# Altium schematic sheet [02] CPU 1214C DC_DC_DC.SchDoc
size A4
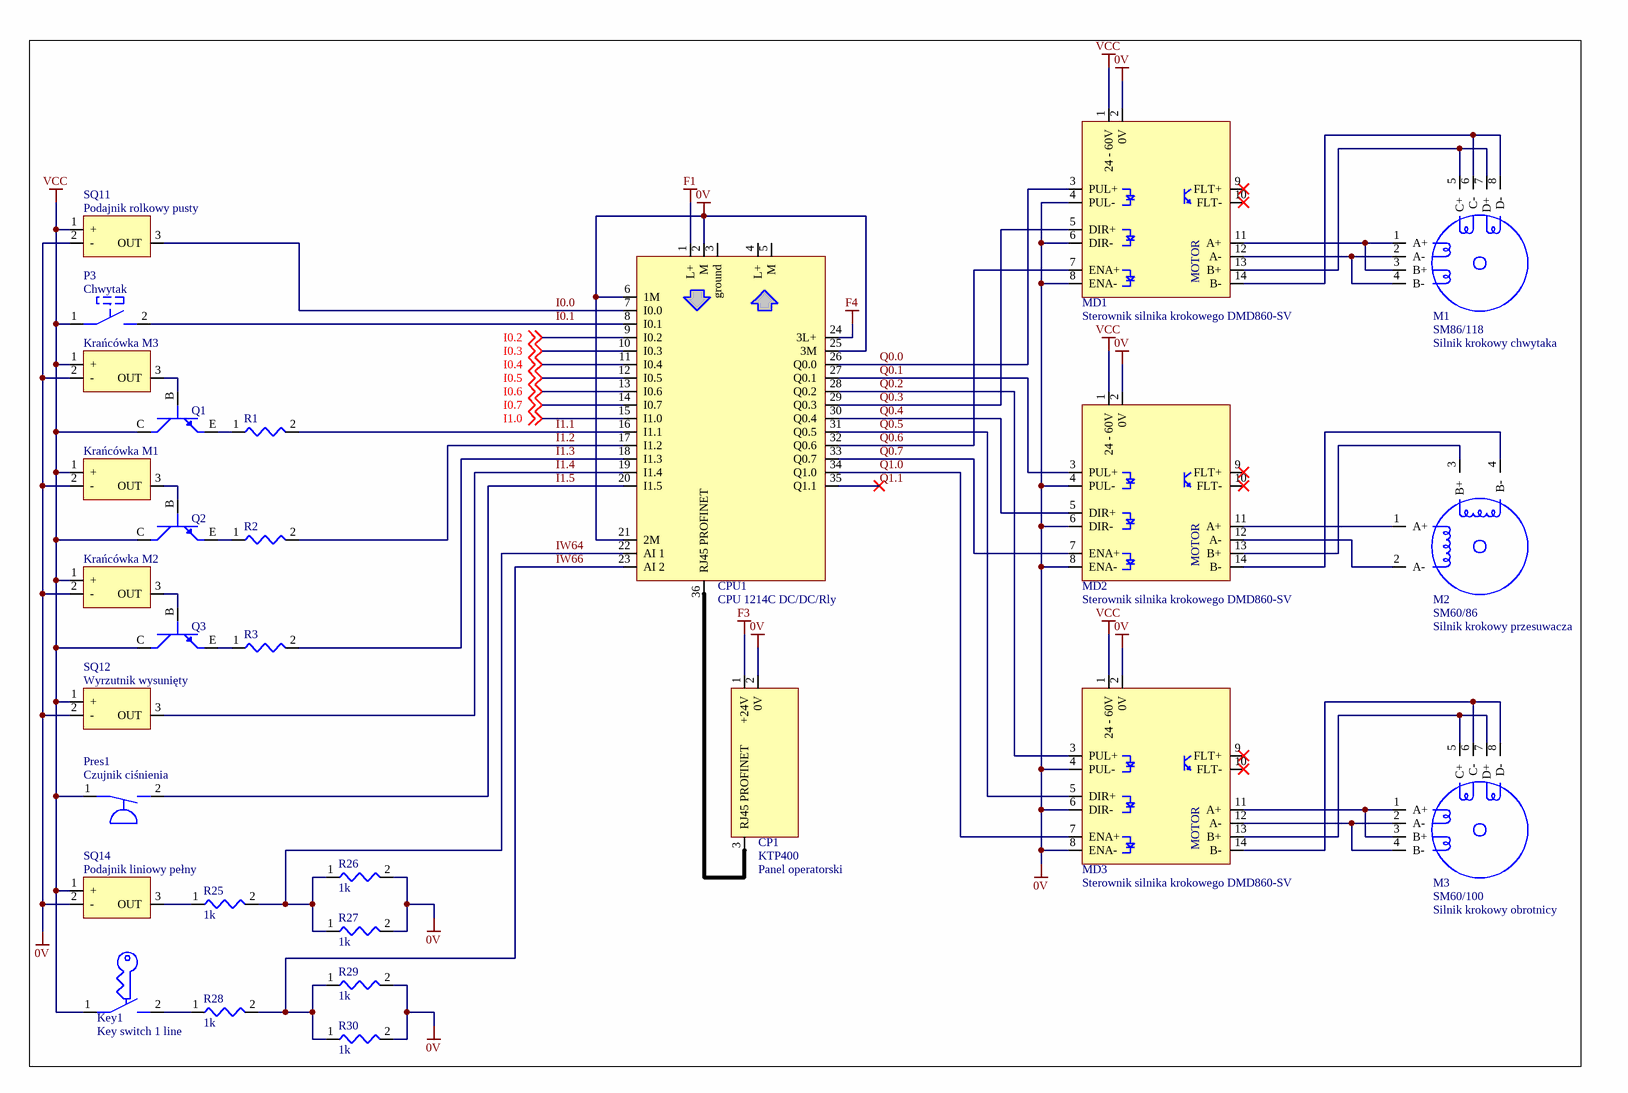
[diagram p0: [02] CPU 1214C DC_DC_DC.SchDoc]

## Parts
CP1  KTP400
CPU1  CPU 1214C DC/DC/Rly
Key1  Key switch 1 line
LM1  Krańcówka M1
LM2  Krańcówka M2
LM3  Krańcówka M3
M1  SM86/118
M2  SM60/86
M3  SM60/100
MD1  Sterownik silnika krokowego DMD860-SV
MD2  Sterownik silnika krokowego DMD860-SV
MD3  Sterownik silnika krokowego DMD860-SV
P3  Chwytak
Pres1  Czujnik ciśnienia
Q1  NPN  (value not drawn)
Q2  NPN  (value not drawn)
Q3  NPN  (value not drawn)
R1  ?R?  (value not drawn)
R2  ?R?  (value not drawn)
R3  ?R?  (value not drawn)
R25  1k
R26  1k
R27  1k
R28  1k
R29  1k
R30  1k
SQ11  Podajnik rolkowy pusty
SQ12  Wyrzutnik wysunięty
SQ14  Podajnik liniowy pełny

## Nets
0V: CP1.2(0V) CPU1.2(M) CPU1.6(1M) CPU1.21(2M) CPU1.25(3M) LM1.2(-) LM2.2(-) LM3.2(-) MD1.2(0V) MD1.4(PUL-) MD1.6(DIR-) MD1.8(ENA-) MD2.2(0V) MD2.4(PUL-) MD2.6(DIR-) MD2.8(ENA-) MD3.2(0V) MD3.4(PUL-) MD3.6(DIR-) MD3.8(ENA-) R26.2 R27.2 R29.2 R30.2 SQ11.2(-) SQ12.2(-) SQ14.2(-)
F1: CPU1.1(L+)
F3: CP1.1(+24V)
F4: CPU1.24(3L+)
VCC: Key1.1 LM1.1(+) LM2.1(+) LM3.1(+) MD1.1(24_-_60V) MD2.1(24_-_60V) MD3.1(24_-_60V) P3.1 Pres1.1 Q1.C Q2.C Q3.C SQ11.1(+) SQ12.1(+) SQ14.1(+)
I0.0: CPU1.7(I0.0) SQ11.3(OUT)
I0.1: CPU1.8(I0.1) P3.2
I0.2: CPU1.9(I0.2) ; off-sheet I0.2
I0.3: CPU1.10(I0.3) ; off-sheet I0.3
I0.4: CPU1.11(I0.4) ; off-sheet I0.4
I0.5: CPU1.12(I0.5) ; off-sheet I0.5
I0.6: CPU1.13(I0.6) ; off-sheet I0.6
I0.7: CPU1.14(I0.7) ; off-sheet I0.7
I1.0: CPU1.15(I1.0) ; off-sheet I1.0
I1.1: CPU1.16(I1.1) R1.2
I1.2: CPU1.17(I1.2) R2.2
I1.3: CPU1.18(I1.3) R3.2
I1.4: CPU1.19(I1.4) SQ12.3(OUT)
I1.5: CPU1.20(I1.5) Pres1.2
IW64: CPU1.22(AI_1) R25.2 R26.1 R27.1
IW66: CPU1.23(AI_2) R28.2 R29.1 R30.1
Q0.0: CPU1.26(Q0.0) MD1.3(PUL+)
Q0.1: CPU1.27(Q0.1) MD2.3(PUL+)
Q0.2: CPU1.28(Q0.2) MD3.3(PUL+)
Q0.3: CPU1.29(Q0.3) MD1.5(DIR+)
Q0.4: CPU1.30(Q0.4) MD2.5(DIR+)
Q0.5: CPU1.31(Q0.5) MD3.5(DIR+)
Q0.6: CPU1.32(Q0.6) MD1.7(ENA+)
Q0.7: CPU1.33(Q0.7) MD2.7(ENA+)
Q1.0: CPU1.34(Q1.0) MD3.7(ENA+)
Q1.1: CPU1.35(Q1.1)
NetCP1_3: CP1.3(RJ45_PROFINET) CPU1.36(RJ45_PROFINET)
NetKey1_2: Key1.2 R28.1
NetLM1_3: LM1.3(OUT) Q2.B
NetLM2_3: LM2.3(OUT) Q3.B
NetLM3_3: LM3.3(OUT) Q1.B
NetM1_1: M1.1(A+) M1.3(B+) MD1.11(A+)
NetM1_2: M1.2(A-) M1.4(B-) MD1.12(A-)
NetM1_5: M1.5(C+) M1.7(D+) MD1.13(B+)
NetM1_6: M1.6(C-) M1.8(D-) MD1.14(B-)
NetM2_1: M2.1(A+) MD2.11(A+)
NetM2_2: M2.2(A-) MD2.12(A-)
NetM2_3: M2.3(B+) MD2.13(B+)
NetM2_4: M2.4(B-) MD2.14(B-)
NetM3_1: M3.1(A+) M3.3(B+) MD3.11(A+)
NetM3_2: M3.2(A-) M3.4(B-) MD3.12(A-)
NetM3_5: M3.5(C+) M3.7(D+) MD3.13(B+)
NetM3_6: M3.6(C-) M3.8(D-) MD3.14(B-)
NetQ1_E: Q1.E R1.1
NetQ2_E: Q2.E R2.1
NetQ3_E: Q3.E R3.1
NetR25_1: R25.1 SQ14.3(OUT)

Not connected (* = marked no-connect by the designer): CPU1 3(ground) 4(L+) 5(M); MD1 9(FLT+)* 10(FLT-)*; MD2 9(FLT+)* 10(FLT-)*; MD3 9(FLT+)* 10(FLT-)*

## Notes on the sheet
- Silnik krokowy chwytaka
- Silnik krokowy przesuwacza
- (near CP1) Panel operatorski
- Silnik krokowy obrotnicy
- (in symbol Stepper motor driver DMD860-SV) MOTOR

## Library data of the parts
CP1 = KTP 400 Basic
CPU1 = CPU 1214C DC/DC/DC
LM1-LM3 SQ11 SQ12 SQ14 = Sensor PNP
M1 M3 = Stepper motor 8-wire small
M2 = Stepper motor 4-wire small
MD1-MD3 = Stepper motor driver DMD860-SV
P3 = Button NO
Pres1 = Pressostat NO
Q1-Q3 = NPN Transistor
R1-R3 R25-R30 = Resistor